# EAGLE design BLE-LORA-Relay-30dbm-v1-1 (EAGLE 8.6.0)
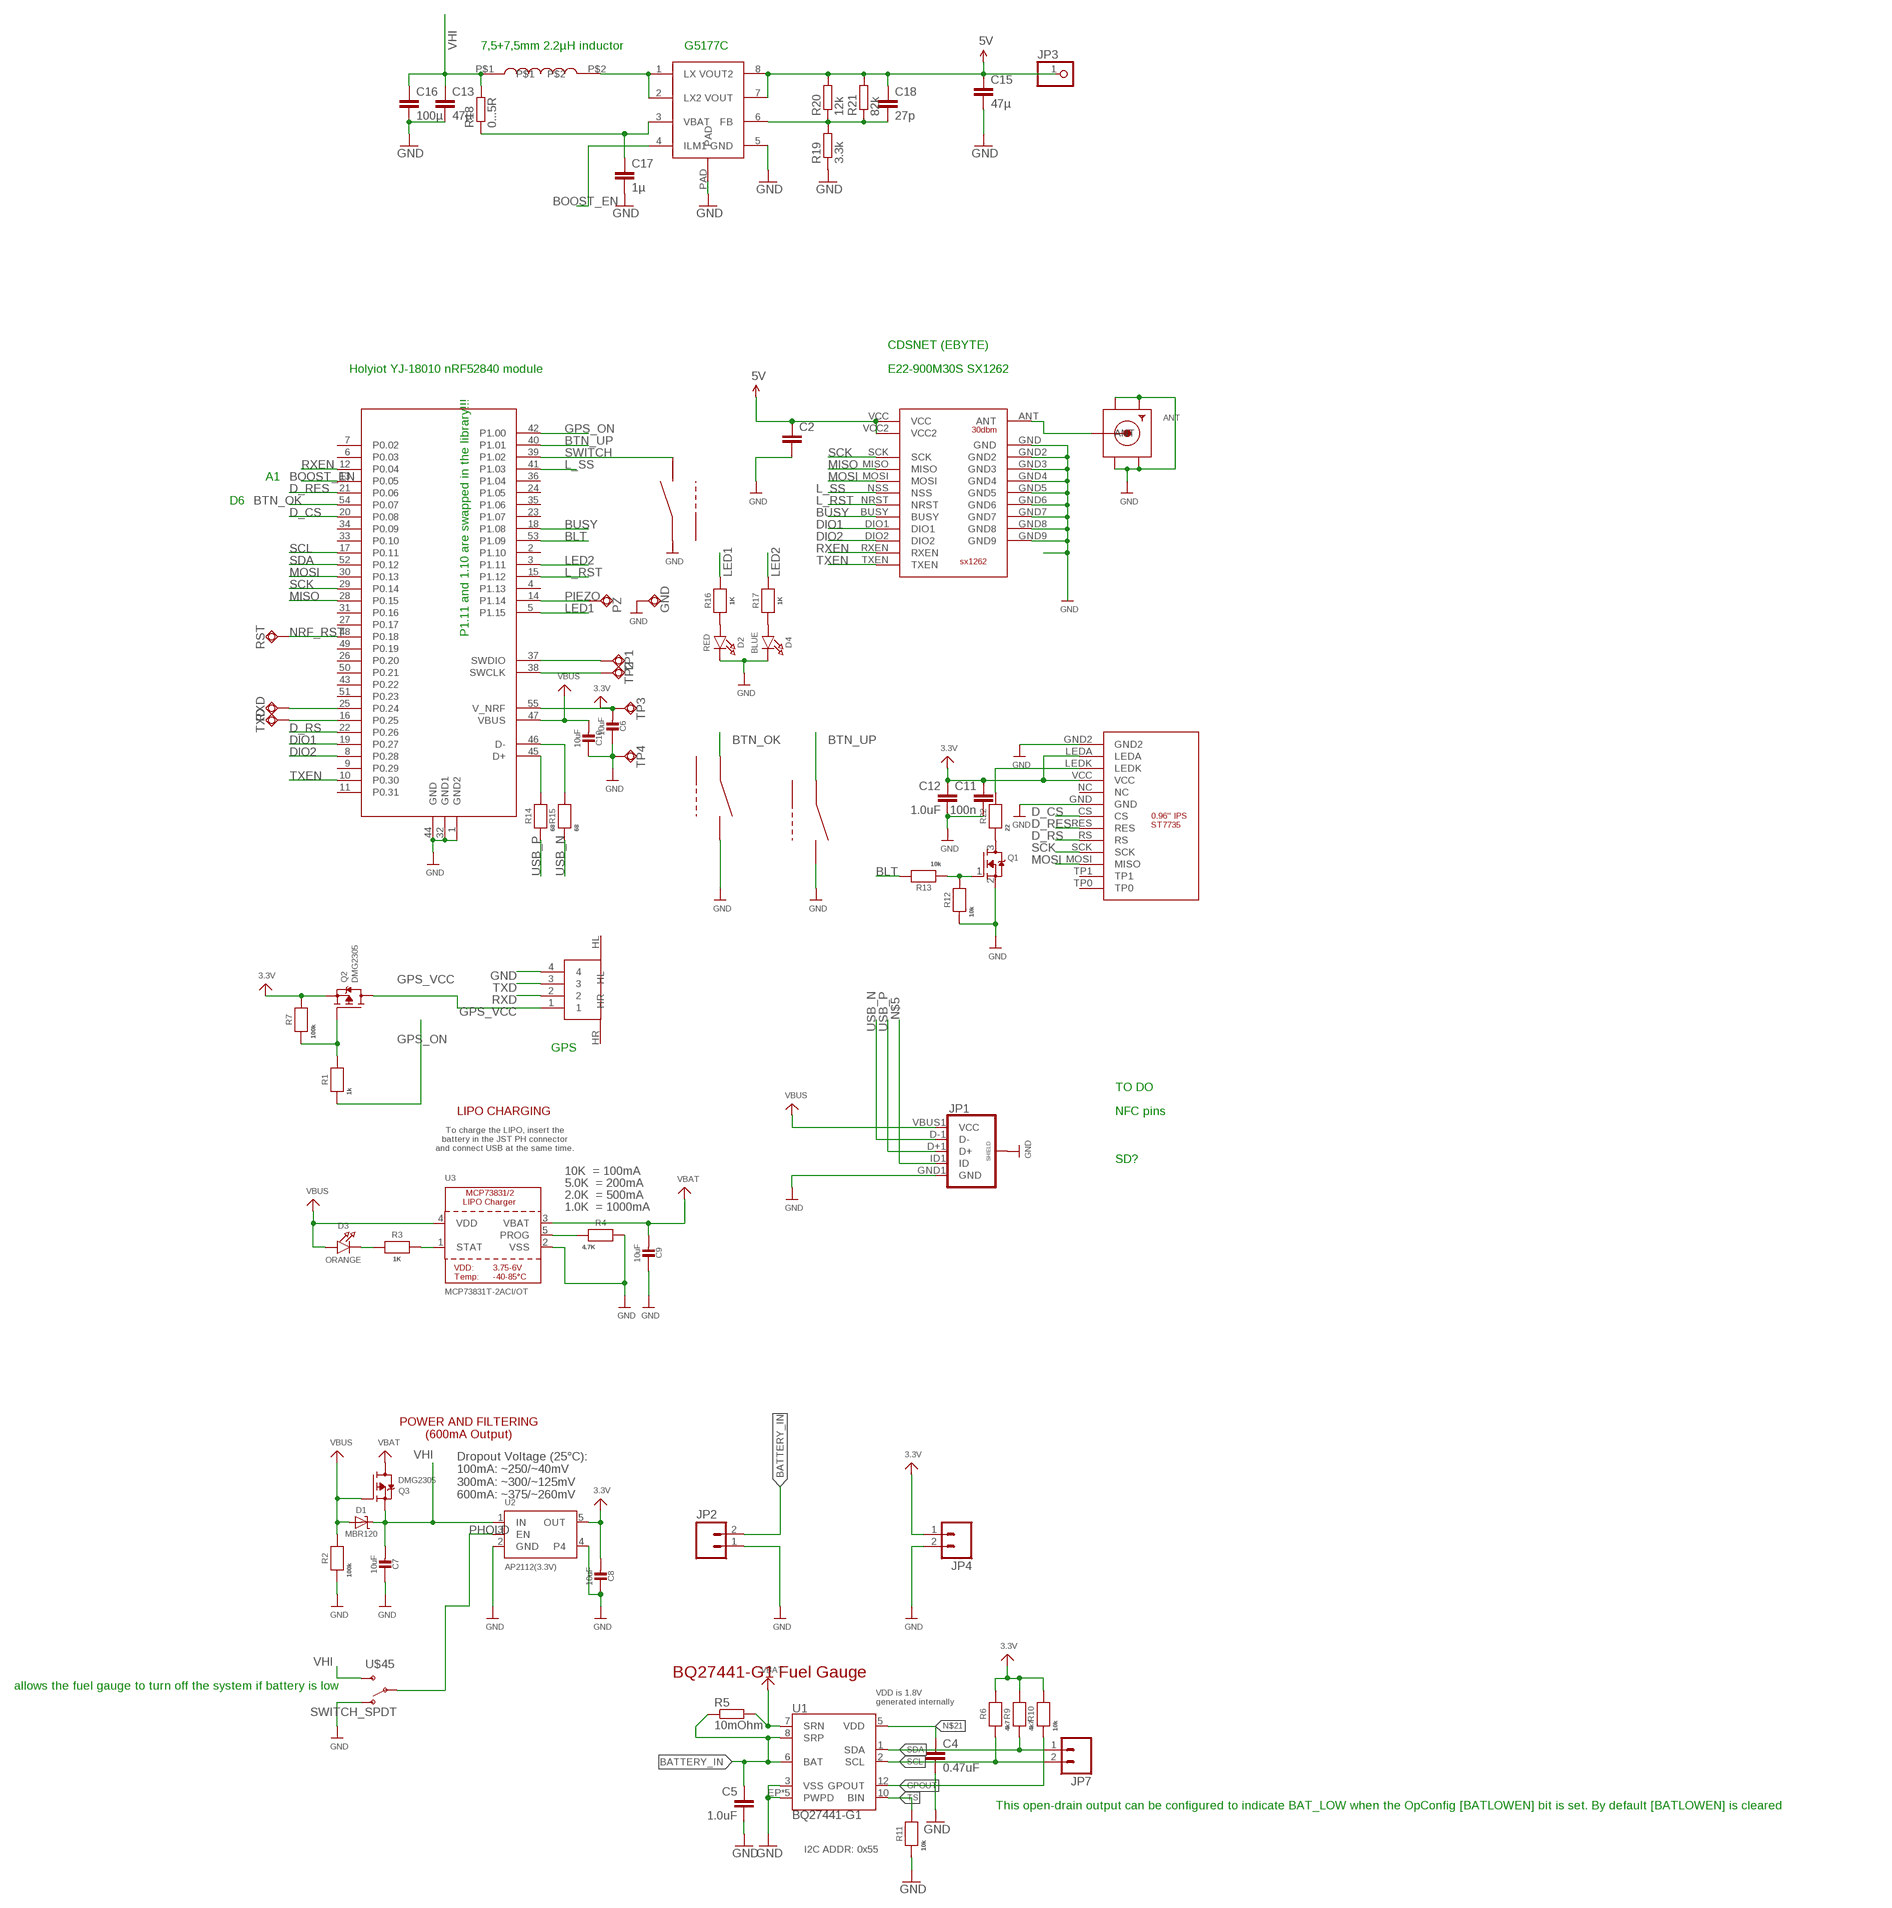
[diagram p0: schematic, sheet 1]

## Parts
ANT  SMACONNECTOR_EDGE  [SMA_EDGELAUNCH]
C2  C-EUC1206  [C1206]
C4  0.47uF  CAP0603-CAP  [0603-CAP]
C5  1.0uF  1.0UF-16V-10%(0603)  [0603-CAP]
C6  10uF  CAP_CERAMIC0805-NOOUTLINE  [0805-NO]
C7  10uF  CAP_CERAMIC0805-NOOUTLINE  [0805-NO]
C8  10uF  CAP_CERAMIC0805-NOOUTLINE  [0805-NO]
C9  10uF  CAP_CERAMIC0805-NOOUTLINE  [0805-NO]
C10  10uF  CAP_CERAMIC0805-NOOUTLINE  [0805-NO]
C11  100n  1.0UF-16V-10%(0603)  [0603-CAP]
C12  1.0uF  1.0UF-16V-10%(0603)  [0603-CAP]
C13  47µ  C-EUC0805  [C0805]
C15  47µ  C-EUC0805  [C0805]
C16  100µ  C-EUC1206  [C1206]
C17  1µ  C-EUC0603  [C0603]
C18  27p  C-EUC0603  [C0603]
D1  MBR120  DIODE-SCHOTTKYSOD-123  [SOD-123]
D2  RED  LED0805_NOOUTLINE  [CHIPLED_0805_NOOUTLINE]
D3  ORANGE  LED0805_NOOUTLINE  [CHIPLED_0805_NOOUTLINE]
D4  BLUE  LED0805_NOOUTLINE  [CHIPLED_0805_NOOUTLINE]
DWN  LS12T2  [LS12T2]
DWN1  LS12T2  [LS12T2]
DWN2  LS12T2  [LS12T2]
GND  TPSQTP13R  [TP13R]
JP1  USB_MICROB_PLUGCONN-11752  [USB-B-MICRO-SMD_V03]
JP2  M02PTH  [1X02]
JP3  PINHD-1X1  [1X01]
JP4  M02PTH  [1X02]
JP7  M02PTH  [1X02]
PZ  TPSQTP13R  [TP13R]
Q1  MOSFET-NREFLOW  [SOT23]
Q2  DMG2305  MOSFET-P  [SOT23-R]
Q3  DMG2305  MOSFET-P  [SOT23-R]
R1  1k  RESISTOR_0603_NOOUT  [0603-NO]
R2  100k  RESISTOR_0603_NOOUT  [0603-NO]
R3  1K  RESISTOR_0603_NOOUT  [0603-NO]
R4  4.7K  RESISTOR_0603_NOOUT  [0603-NO]
R5  10mOhm  R-EU_R0805  [R0805]
R6  4k7  RESISTOR_0603_NOOUT  [0603-NO]
R7  100k  RESISTOR_0603_NOOUT  [0603-NO]
R9  4k7  RESISTOR_0603_NOOUT  [0603-NO]
R10  10k  RESISTOR_0603_NOOUT  [0603-NO]
R11  10k  RESISTOR_0603_NOOUT  [0603-NO]
R12  10k  RESISTOR_0603_NOOUT  [0603-NO]
R13  10k  RESISTOR_0603_NOOUT  [0603-NO]
R14  68  RESISTOR_0603_NOOUT  [0603-NO]
R15  68  RESISTOR_0603_NOOUT  [0603-NO]
R16  1K  RESISTOR_0603_NOOUT  [0603-NO]
R17  1K  RESISTOR_0603_NOOUT  [0603-NO]
R18  0...5R  R-EU_R0603  [R0603]
R19  3.3k  R-EU_R0603  [R0603]
R20  12k  R-EU_R0603  [R0603]
R21  82k  R-EU_R0603  [R0603]
R22  22  RESISTOR_0603_NOOUT  [0603-NO]
RST  TPSQTP13R  [TP13R]
RXD  TPSQTP13R  [TP13R]
TP1  TPSQTP13R  [TP13R]
TP2  TPSQTP13R  [TP13R]
TP3  TPSQTP13R  [TP13R]
TP4  TPSQTP13R  [TP13R]
TXD  TPSQTP13R  [TP13R]
U1  BQ27441-G1  [PDSO-N12]
U2  AP2112(3.3V)  VREG_SOT23-5  [SOT23-5]
U3  MCP73831T-2ACI/OT  MCP73831/2  [SOT23-5]
U$14  NRF52840  [NRF52840MOD]
U$15  SX1262-30DBM  [SX1262-30DBM]
U$16  0.96_IPS  [0.96_IPS]
U$17  JST-SH-3  [JST-SH-3]
U$35  7.5MM-COIL  [7.5MM_COIL]
U$41  G5177C  [SO-08]
U$45  SWITCH_SPDT  [KPS-1290]

## Nets
3.3V [USB]: C6.2 C8.2 C11.1 C12.1 JP4.1 Q2.2(S) R6.2 R7.2 R9.2 R10.2 TP3.TP U2.5(OUT) U$14.55(V_NRF) U$16.LEDA U$16.VCC
5V: C2.1 C15.1 C18.1 JP3.1 R20.2 R21.2 U$15.VCC U$15.VCC2 U$41.7(VOUT) U$41.8(VOUT2)
BATTERY_IN: C5.1 JP2.2 R5.1 U1.6(BAT) U1.8(SRP)
BLT: R13.2 U$14.53(P1.09)
BOOST_EN: U$14.13(P0.05) U$41.4(ILM1)
BTN_OK [USB]: DWN.2 U$14.54(P0.07)
BTN_UP: DWN1.2 U$14.40(P1.01)
BUSY: U$14.18(P1.08) U$15.BUSY
D_CS: U$14.20(P0.08) U$16.CS
D_RES: U$14.21(P0.06) U$16.RES
D_RS: U$14.22(P0.26) U$16.RS
DIO1: U$14.19(P0.27) U$15.DIO1
DIO2: U$14.8(P0.28) U$15.DIO2
FB: C18.2 R19.2 R20.1 R21.1 U$41.6(FB)
GND: ANT.GND@1(GND4) ANT.GND@2(GND3) ANT.GND@3(GND2) ANT.GND@4(GND1) C2.2 C4.2 C5.2 C6.1 C7.1 C8.1 C9.1 C10.1 C11.2 C12.2 C13.2 C15.2 C16.2 C17.2 D2.C D4.C DWN1.1 DWN2.2 DWN.1 GND.TP JP1.GND1(GND) JP1.SHIELD1(SHIELD) JP1.SHIELD2(SHIELD) JP1.SHIELD3(SHIELD) JP2.1 JP4.2 Q1.2(S) R2.1 R4.2 R11.1 R12.1 R19.1 TP4.TP U1.3(VSS) U1.EP1(PWPD) U1.EP2(PWPD) U1.EP3(PWPD) U1.EP4(PWPD) U1.EP(PWPD) U2.2(GND) U2.4 U3.2(VSS) U$14.1(GND2) U$14.32(GND1) U$14.44(GND) U$15.GND U$15.GND2 U$15.GND3 U$15.GND4 U$15.GND5 U$15.GND6 U$15.GND7 U$15.GND8 U$15.GND9 U$16.GND U$16.GND2 U$17.4 U$41.5(GND) U$41.PAD U$45.O
GPOUT: R10.1 U1.12(GPOUT)
GPS_ON: R1.1 U$14.42(P1.00)
GPS_VCC: Q2.3(D) U$17.1
L_RST: U$14.15(P1.12) U$15.NRST
L_SS: U$14.41(P1.03) U$15.NSS
LED1: R16.2 U$14.5(P1.15)
LED2: R17.2 U$14.3(P1.11)
MISO: U$14.28(P0.15) U$15.MISO
MOSI: U$14.30(P0.13) U$15.MOSI U$16.MOSI(MISO)
N$1: D3.C R3.1
N$2: Q1.1(G) R12.2 R13.1
N$3: ANT.P(ANT) U$15.ANT
N$4: R22.2 U$16.LEDK
N$5: JP1.ID1(ID)
N$6: R14.2 U$14.45(D+)
N$7: R15.2 U$14.46(D-)
N$8: Q2.1(G) R1.2 R7.1
N$11: R3.2 U3.1(STAT)
N$12: R4.1 U3.5(PROG)
N$13: D2.A R16.1
N$14: D4.A R17.1
N$15: Q1.3(D) R22.1
N$16: C17.1 R18.1 U$41.3(VBAT)
N$17: U$35.P$2 U$41.1(LX) U$41.2(LX2)
N$21: C4.1 U1.5(VDD)
NRF_RST: RST.TP U$14.48(P0.18)
PHOLD: U2.3(EN) U$45.P
PIEZO: PZ.TP U$14.14(P1.14)
RXD: RXD.TP U$14.25(P0.24) U$17.2
RXEN: U$14.12(P0.04) U$15.RXEN
SCK: U$14.29(P0.14) U$15.SCK U$16.SCK
SCL: JP7.2 R6.1 U1.2(SCL) U$14.17(P0.11)
SDA: JP7.1 R9.1 U1.1(SDA) U$14.52(P0.12)
SWCLK: TP2.TP U$14.38(SWCLK)
SWDIO: TP1.TP U$14.37(SWDIO)
SWITCH: DWN2.1 U$14.39(P1.02)
TS: R11.2 U1.10(BIN)
TXD: TXD.TP U$14.16(P0.25) U$17.3
TXEN: U$14.10(P0.30) U$15.TXEN
USB_N: JP1.D-1(D-) R15.1
USB_P: JP1.D+1(D+) R14.1
VBAT [USB]: C9.2 Q3.3(D) R5.2 U1.7(SRN) U3.3(VBAT)
VBUS [USB]: C10.2 D1.A D3.A JP1.VBUS1(VCC) Q3.1(G) R2.2 U3.4(VDD) U$14.47(VBUS)
VHI [USB]: C7.2 C13.1 C16.1 D1.C Q3.2(S) R18.2 U2.1(IN) U$35.P$1 U$45.S
Unconnected: DWN1.FRAME(FRM) DWN2.FRAME(FRM) DWN.FRAME(FRM) U$14.2(P1.10) U$14.4(P1.13) U$14.6(P0.03) U$14.7(P0.02) U$14.9(P0.29) U$14.11(P0.31) U$14.23(P1.07) U$14.24(P1.05) U$14.26(P0.20) U$14.27(P0.17) U$14.31(P0.16) U$14.33(P0.10) U$14.34(P0.09) U$14.35(P1.06) U$14.36(P1.04) U$14.43(P0.22) U$14.49(P0.19) U$14.50(P0.21) U$14.51(P0.23) U$16.NC U$16.TP0 U$16.TP1 U$17.HL U$17.HR

## Notes on the sheet
- 7,5+7,5mm 2.2µH inductor | G5177C
- CDSNET (EBYTE)
- Holyiot YJ-18010 nRF52840 module | E22-900M30S SX1262
- A1
- D6
- P1.11 and 1.10 are swapped in the library!!!
- GPS
- TO DO
- LIPO CHARGING | NFC pins
- To charge the LIPO, insert the
  battery in the JST PH connector
  and connect USB at the same time.
- SD?
- 10K  = 100mA
- 5.0K  = 200mA
- 2.0K  = 500mA
- 1.0K  = 1000mA
- POWER AND FILTERING
  (600mA Output)
- Dropout Voltage (25°C):
  100mA: ~250/~40mV
  300mA: ~300/~125mV
  600mA: ~375/~260mV
- BQ27441-G1 Fuel Gauge
- allows the fuel gauge to turn off the system if battery is low
- VDD is 1.8V
  generated internally
- This open-drain output can be configured to indicate BAT_LOW when the OpConfig [BATLOWEN] bit is set. By default [BATLOWEN] is cleared
- I2C ADDR: 0x55

## Library data of the parts
ANT = adafruit:SMACONNECTOR: SMA Connector 90° DIP SMA Connector, 50 Ohm (4UConnector: 07259)
C2 C13 C15-C18 = rcl:C-EU: CAPACITOR, European symbol
C4 = SparkFun-Capacitors:CAP: Capacitor Standard 0603 ceramic capacitor, and 0.1" leaded capacitor.; PROD_ID: CAP-13216
C5 C12 = SparkFun-Capacitors:1.0UF-16V-10%(0603): CAP-00868; PROD_ID: CAP-00868
C6-C10 = microbuilder:CAP_CERAMIC: Ceramic Capacitors For new designs, use the packages preceded by an '_' character since they are more reliable: The following footprints should be used on most boards: _0402 - Standard footprint for regular board layouts _0603 - Standard footprint for regular board layouts _0805 - Standard footprint for regular board layouts _1206 - Standard footprint for regular board layouts For extremely tight-pitch boards where space is at a premium, the following 'micro-pitch' footprints can be used (smaller pads, no silkscreen outline, etc.): _0402MP - Micro-pitch footprint for very dense/compact boards _0603MP - Micro-pitch footprint for very dense/compact boards _0805MP - Micro-pitch footprint for very dense/compact boards _1206MP - Micro-pitch footprint for very dense/compact boards
C11 = SparkFun-Capacitors:1.0UF-16V-10%(0603): CAP-00868; PROD_ID: CAP-00868; VALUE: 1.0uF
D1 = microbuilder:DIODE-SCHOTTKY
D2-D4 = microbuilder:LED: LED 0603 - 0603 Surface Mount Package 2mA: Green LED - Low Power (3.9mcd, 2ma, 1.7Vf) - Digikey: 475-2709-2-ND Orange LED - Low Power (9.8mcd, 2ma, 1.8Vf) - Digikey: 475-1194-2-ND Red LED - Low Power (5mcd, 2ma, 1.8Vf) - Digikey: 475-1195-2-ND Yellow LED - Low Power (7mcd, 2ma, 1.8Vf) - Digikey: 475-1196-2-ND 5mA: Blue LED - Low Power (17mcd, 5ma, 2.9Vf) - Digikey: LNJ937W8CRACT-ND 0805 - 0805 Surface Mount Package 2mA: Red LED (8.8mcd, 2mA, 1.8Vf, Clear) - Low Power [Digikey: 475-2510-1-ND] Green LED (5mcd, 2mA, 1.8Vf, Clear) - Low Power [Digikey: 475-2730-1-ND] Yellow LED (11.3mcd, 2mA, 1.8Vf, Clear) - Low Power [Digikey: 475-2555-1-ND] 20mA: Red LED (104mcd, 20mA, Diffused) - LS R976 [Digikey: 475-1278-6-ND] Red LED (12mcd, 20mA, 2.0Vf, Clear) - APT2012EC [Digikey: 754-1128-1-ND] Green LED (15mcd, 20mA, 2.2Vf, Clear) - APT2012GC [Digikey: 754-1131-1-ND] Orange LED (160mcd, 20mA, 2.1Vf, Clear) - APT2012SECK [Digikey: 754-1130-1-ND] 1206 - 1206 Surface Mount Package Green LED (26mcd, 20mA, Diffused) - LG N971 [Digikey: 475-1407-6-ND] Red LED (15mcd, 20mA, Diffused) - LH N974 [Digikey: 475-1416-6-ND] Cree - Cree High-Power Surface Mount LEDs XPEBWT-L1-0000-00D50 - White 111lm 350mA 2.9Vf 6200K 110° XTEAWT-00-0000-00000LEE3 - White 114lm 350mA 2.85Vf 5000K 115° Everlight - Everlight 45-21 Series Surface Mount LEDs 45-21/QK2C-B2832AC2CB2/2T - Warm White 2000mcd 20mA 3.25Vf 3050K 120° 45-21/LK2C-B38452C4CB2/2T - Nuetral White 2000mcd 20mA 3.25Vf 4150K 120° 45-21/LK2C-B50634C6CB2/2T - Cold White 2200mcd 20mA 3.25Vf 5650K 120° PLCC2 Reverse Mount LS T77K-J1L2-1-0-2-R18-Z - Red 11.25mcd 2mA 1.8Vf 630nm 120° LO T77K-L1M2-24-Z - Orange 19.6mcd 2mA 1.8Vf 606nm 120° LY T77K-K2M1-26-Z - Yellow 15.7mcd 2mA 1.8Vf 587nm 120°
DWN DWN1 DWN2 = LS12T2:LS12T2
GND PZ RST RXD TP1-TP4 TXD = testpad:TPSQ: Test pad
JP1 = SparkFun-Connectors:USB_MICROB_PLUG: USB Micro-B connectors Some male, some female. Watch your step!; PROD_ID: CONN-11752
JP2 JP4 JP7 = SparkFun-Connectors:M02: Standard 2-pin 0.1" header. Use with - straight break away headers ( PRT-00116) - right angle break away headers (PRT-00553) - swiss pins (PRT-00743) - machine pins (PRT-00117) - female headers (PRT-00115) Molex polarized connector foot print use with: PRT-08233 with associated crimp pins and housings. 2.54_SCREWTERM for use with PRT-10571. 3.5mm Screw Terminal footprints for PRT-08084 5mm Screw Terminal footprints for use with PRT-08432
JP3 = adafruit:PINHD-1X1: Pin header 1x1 for 0.1" spacing With round pins
Q1 = adafruit:MOSFET-N: N-Channel Mosfet 2N7002E - 60V 260mA SOT23 [Digikey: 2N7002ET1GOSTR-ND] - REEL BSH103 - 30V 850mA SOT23 [Digikey: 568-5013-1-ND]
Q2 Q3 = microbuilder:MOSFET-P: P-Channel Mosfet LEGEND VDS: Voltage Drain-Source ID: Drain Current RDS(ON): Drain-Source On-State Resistance VGS(TH): Gate-Source Threshold Voltage CISS: Drain-Source Input Capacitance SOT-23 Name VDS ID RDS(ON) VGS(TH) CISS Order Number IRLML5103 30V 760mA 600 mOhm -- 75pF @ 25V Digikey: IRLML5103PBFCT-ND IRLML6401 12V 4.3A 50 mOhm 950mV @ 250µA 830pF @ 10V Digikey: IRLML6401PBFTR-ND NTR0202PL 20V 400mA 800 mOhm 2.3V @ 250uA 70pF @ 5V Digikey: NTR0202PLT1GOSTR-ND NTR4101PT1G 20V 1.8A 85 mOhm 1.2V @ 250uA 675pF @ 10V Digikey: NTR4101PT1GOSCT-ND DMP2004K 20V 600mA 900 mOhm 1V @ 250uA 175pF @ 16V Digikey: DMP2004KDICT-ND PMV65XP 20V 3.9A 76 mOhm 950mV @ 1mA 725pF @ 20V Digikey: 568-2358-2-ND TO-252 Name VDS ID RDS(ON) VGS(TH) CISS Order Number AOD417 30V 25A 34 mOhm 3V @ 250µA 920pF @ 15V Digikey: 785-1106-2-ND PowerPak Name VDS ID RDS(ON) VGS(TH) CISS Order Number AON7401 30V 12A 14 mOhm 3V @ 250µA 2600pF @ 15V Digikey: 785-1302-1-ND
R1-R4 R6 R7 R9-R17 R22 = microbuilder:RESISTOR: Resistors For new designs, use the packages preceded by an '_' character since they are more reliable: The following footprints should be used on most boards: _0402 - Standard footprint for regular board layouts _0603 - Standard footprint for regular board layouts _0805 - Standard footprint for regular board layouts _1206 - Standard footprint for regular board layouts For extremely tight-pitch boards where space is at a premium, the following 'micro-pitch' footprints can be used (smaller pads, no silkscreen outline, etc.): _0402MP - Micro-pitch footprint for very dense/compact boards _0603MP - Micro-pitch footprint for very dense/compact boards _0805MP - Micro-pitch footprint for very dense/compact boards _1206MP - Micro-pitch footprint for very dense/compact boards
R5 R18-R21 = rcl:R-EU_: RESISTOR, European symbol
U1 = battery-management-temp:BQ27441-G1; PROD_ID: IC-13220
U2 = microbuilder:VREG_SOT23-5: SOT23-5 Fixed Voltage Regulators Part Current Out V Out V In V Dropout θJA (°C/W) TJ (°C) Digikey Part No. ADP121 150mA 3.3V 3.4-5.5V 0.09V @ 150mA -- -- ADP121-AUJZ33R7CT-ND ADP121 150mA 3.0V 3.1-5.5V 0.09V @ 150mA -- -- ADP121-AUJZ30R7CT-ND ADP122 300mA 3.3V 3.4-5.5V 0.085V @ 300mA -- -- ADP122AUJZ-3.3-R7CT-ND ADP1712 300mA 3.3V 3.5-5.5V 0.17V @ 300mA -- -- ADP1712AUJZ-3.3-R7TR-ND AP7311 (Low Cost) 150mA 3.3V 3.5-6V 0.15V @ 150mA -- -- AP7311-33WG-7DICT-ND LD39015M18R 150mA 1.8V 1.9V-5.5V 0.08V @ 100mA -- -- 497-6977-1-ND LP2985A-33DBVR 150mA 3.3V 3.3-16V 0.28V @ 150mA 206 150 296-18479-1-ND MCP1824T-3302E/OT 300mA 3.3V 3.5V-6V 0.2V @ 300mA -- -- MCP1824T-3302E/OTCT-ND MIC5205-2.5YM5 TR 150mA 2.5V 2.7-16V 0.165V @ 150mA -- -- 576-1257-2-ND MIC5205-3.0YM5 TR 150mA 3.0V 3.2V-16V 0.165V @ 150mA -- -- 576-1258-2-ND MIC5205-3.3YM5 TR 150mA 3.3V 3.5V-16V 0.165V @ 150mA -- -- 576-1259-2-ND TPS780330220 150mA 3.3V+2.2V 3.6-5.5V 250mV Max -- -- 296-23332-1-ND TDA3663/N1,135 100mA 3.3V 3.5-45V 0.18V @ 50mA -- -- 568-5343-1-ND Max operating temp can be calculated using θJA, TJ (max junction temperature), and power in watts. Set the "Maximum Ambient Temperature" until it reaches TJ ("Max Junction Temperature"), which is the absolute limit for safe use of the regulator: Heat Sink Temperature Calculator <http://www.daycounter.com/Calculators/Heat-Sink-Temperature-Calculator.phtml> For example, With 12V source into a 3.3V LP2985 and a 30mA load, we are dissipating (12V-3.3V) * 0.03A = 0.261W. With a θJA of 206 °C/W, a TJ of 150°C, and 261mW we can safely use the chip without a heat sink up to 75°C (=147.1°C Junction Temperature).
U3 = microbuilder:MCP73831/2: MCP73831/2 LIPO Charger VDD: 3.75 - 6V Temp -40 - 85°C Programmable Charge Rate: 15-500mA NOTE: STAT is a tri-state logic output on the MCP73831 and an open-drain output on the MCP73832. SOT23-5 with 4.2V output and tri-state logic on STAT = MCP73831T-2ACI/OT
U$14 = nrf52840mod:NRF52840
U$15 = SX1262-30dbm:SX1262-30DBM
U$16 = 0.96_IPS:0.96_IPS
U$17 = JST-SH-4:JST-SH-3
U$35 = 7.5mm-COIL:7.5MM-COIL
U$41 = G5177C:G5177C
U$45 = SparkFun-Retired:SWITCH_SPDT: SWCH-10651 Side-actuated SPDT slide switch, as used on the Arduino Pro; PROD_ID: SWCH-10651

## Net classes
1 USB: width 0.406 mm

## Board
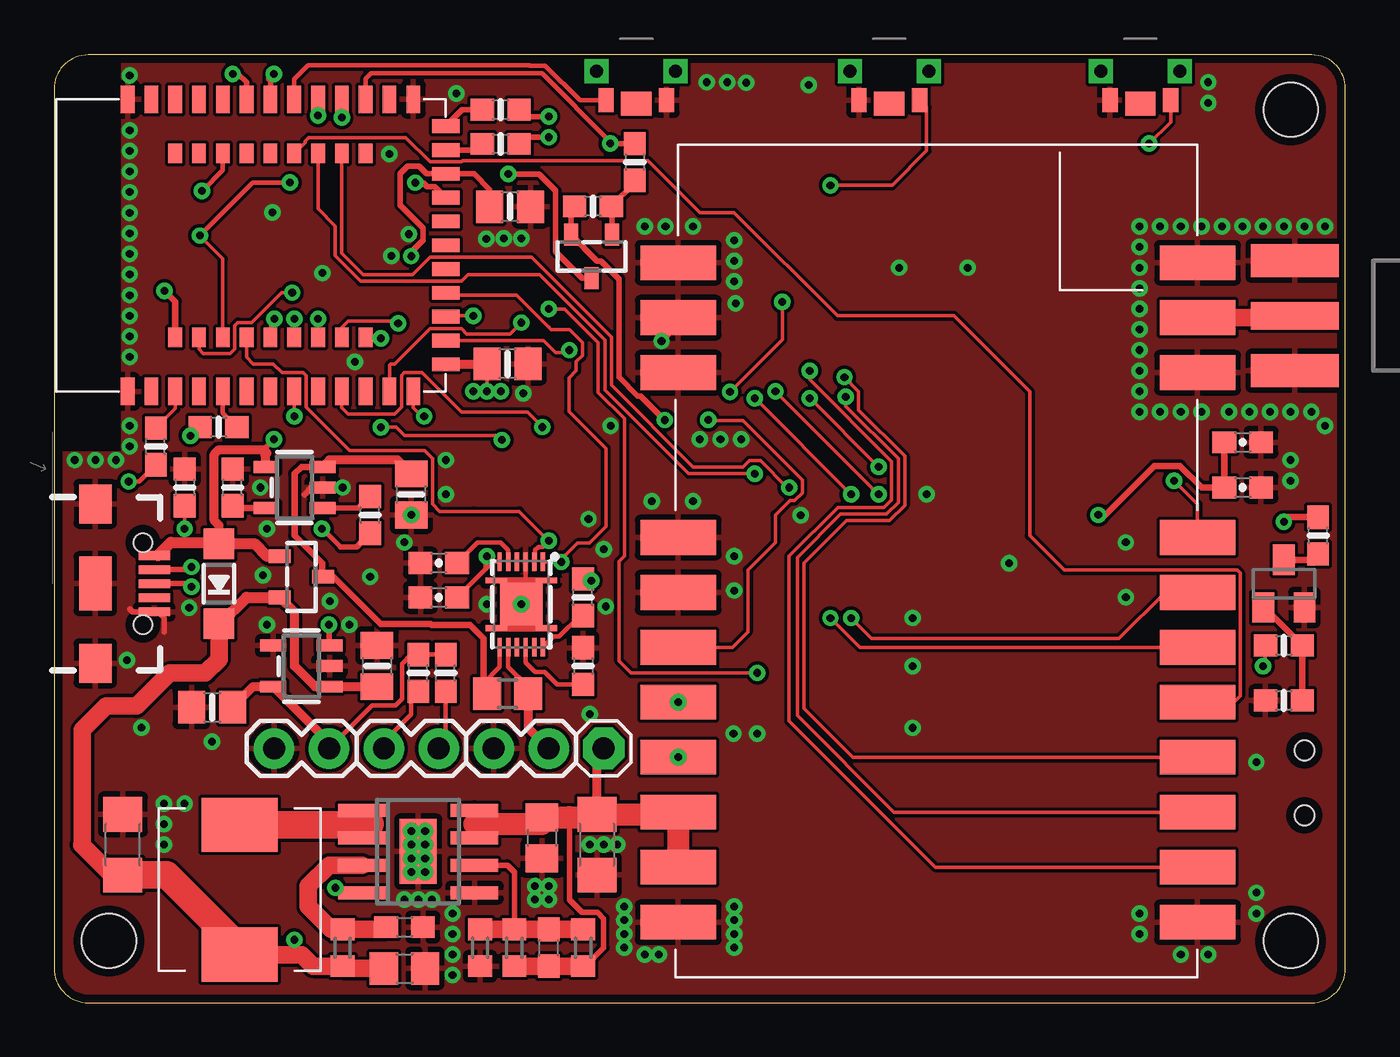
[diagram p1: board, top side]
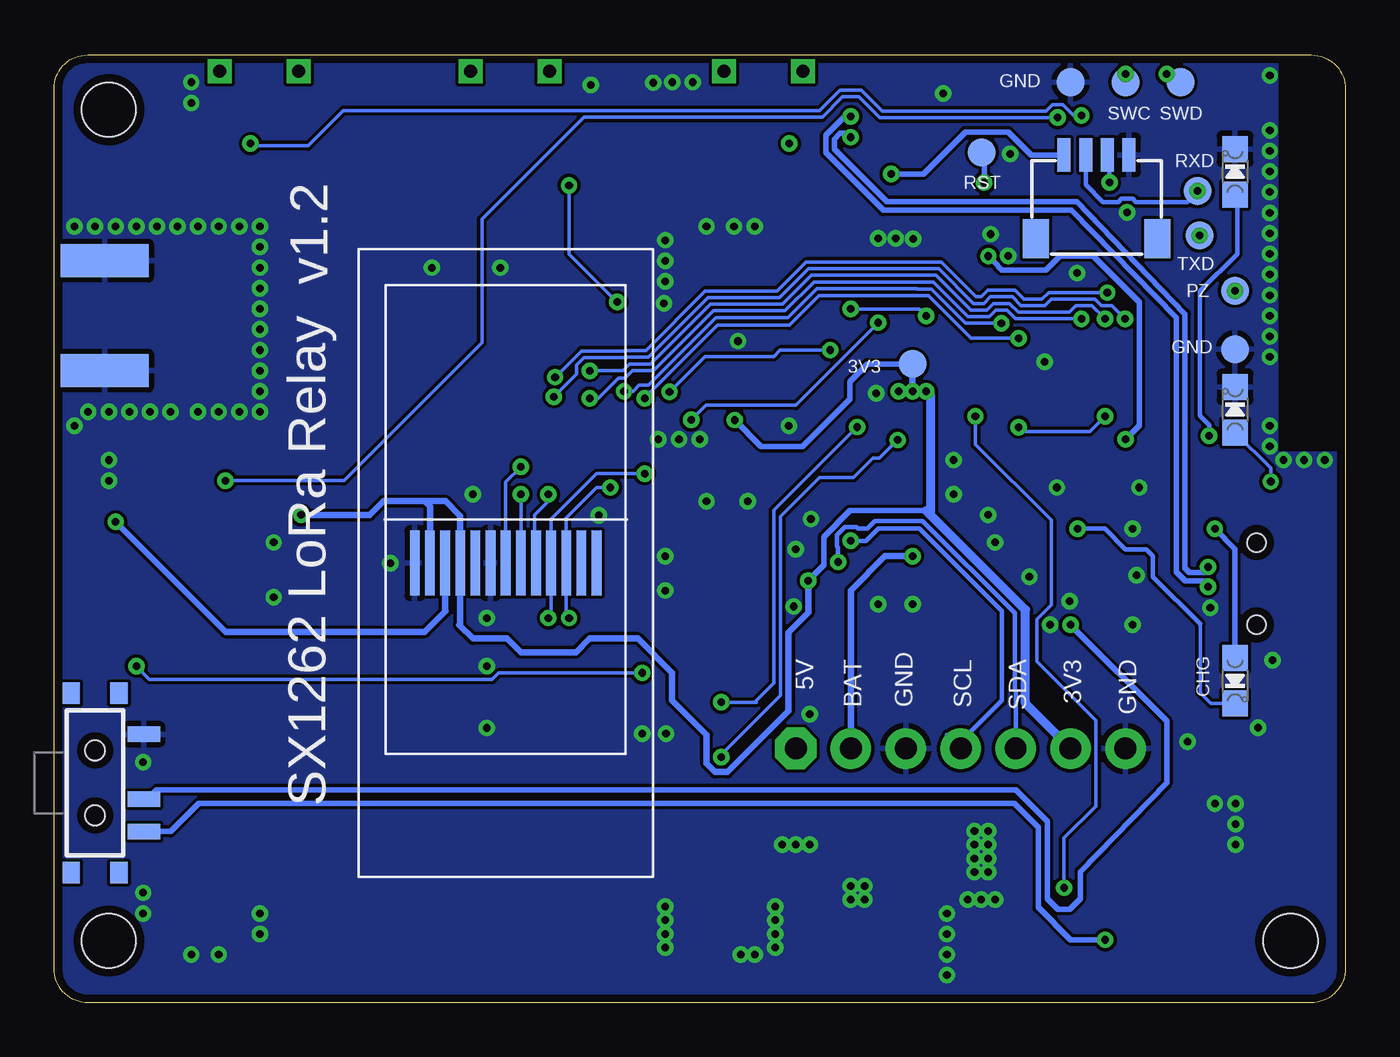
[diagram p2: board, bottom side, seen from below]

Size 59.68 x 43.8 mm. Coordinates in mm from the lower left corner, seen from the top.
Outline: 58.13,43.8 1.57,43.8 arc90 0,42.23 0,1.59 arc90 1.59,0 58.11,0 arc90 59.68,1.57 59.68,42.26 arc90 58.13,43.8
Copper layers (1*16): Top 0.035mm / dielectric 1.5mm / Bottom 0.035mm
Design rules "default *": minimum track width 6mil, minimum drill 0.35mm, track to track 6mil, track to pad 6mil, pad to pad 6mil, via to via 6mil, smd to smd 6mil, copper to edge 15mil, drill to drill 6mil, minimum pad ring 10mil, minimum via ring 8mil, stop-mask expansion 4mil, vias tented up to drill 20mil, thermal gap 10mil
Holes 2.5 mm at 2.54,2.86 57.15,2.86 57.15,41.28

### Footprints (pad centres in the part's own frame; a part is rotated, then mirrored left to right if it is on the bottom)
SMA_EDGELAUNCH = smd 4.064 x 1.524: GND@1 2.032,-2.54; GND@2 2.032,2.54 | smd 4.064 x 1.524 bottom: GND@3 2.032,2.54; GND@4 2.032,-2.54 | smd 4.064 x 1.27: P 2.032,0
C1206 = smd 1.6 x 1.8: 1 -1.4,0; 2 1.4,0
0603-CAP = smd 1.1 x 1: 1 -0.85,0; 2 0.85,0
0805-NO = smd 1.24 x 1.5: 1 -0.95,0; 2 0.95,0
C0805 = smd 1.3 x 1.5: 1 -0.95,0; 2 0.95,0
C0603 = smd 1.1 x 1: 1 -0.85,0; 2 0.85,0
SOD-123 = smd 1.4 x 1.4: A 1.85,0; C -1.85,0
CHIPLED_0805_NOOUTLINE = smd 1.2 x 1.2: A 0,-1.05; C 0,1.05
LS12T2 = smd 1.1 x 0.7: 1 0,1.4; 2 0,-1.4 | smd 1.1 x 1.4: FRAME -0.15,0 | drill 0.6 pad 1.016 square: P$4 1.35,-1.825; P$5 1.35,1.825
TP13R = smd 1.3 x 1.3: TP 0,0
USB-B-MICRO-SMD_V03 = smd 1.45 x 0.4: D+1 2.725,0; D-1 2.725,0.65; GND1 2.725,-1.3; ID1 2.725,-0.65; VBUS1 2.725,1.3 | smd 1.5 x 1.8: SHIELD1 0,3.685; SHIELD2 0,-3.685 | smd 1.5 x 2.5: SHIELD3 0,0 | hole 0.85: 2.2,1.9; 2.2,-1.9
1X02 = drill 1.016 pad 1.88: 1 0,0; 2 2.54,0
1X01 = drill 1.016 pad 1.93 octagon: 1 0,0
SOT23 = smd 1 x 1.4: 1 -0.95,-1.1; 2 0.95,-1.1; 3 0,1.1
SOT23-R = smd 0.635 x 1.016: 1 -0.95,-1; 2 0.95,-1; 3 0,1
0603-NO = smd 1.075 x 1: 1 -0.85,0; 2 0.85,0
R0805 = smd 1.3 x 1.5: 1 -0.95,0; 2 0.95,0
R0603 = smd 1 x 1.1: 1 -0.85,0; 2 0.85,0
PDSO-N12 = smd 0.2 x 0.85: 1 -1,-1.975; 2 -0.6,-1.975; 3 -0.2,-1.975; 4 0.2,-1.975; 5 0.6,-1.975; 6 1,-1.975; 7 1,1.975; 8 0.6,1.975; 9 0.2,1.975; 10 -0.2,1.975; 11 -0.6,1.975; 12 -1,1.975 | smd 1.95 x 1.95: EP 0,0 | smd 1 x 0.25: EP1 -1.15,1.1; EP2 -1.15,-1.1; EP3 1.15,-1.1; EP4 1.15,1.1
SOT23-5 = smd 0.55 x 1.2: 1 -0.95,-1.3; 2 0,-1.3; 3 0.95,-1.3; 4 0.95,1.3; 5 -0.95,1.3
NRF52840MOD = smd 1.27 x 0.635: 1 0,14.7; 2 0,13.6; 3 0,12.5; 4 0,11.4; 5 0,10.3; 6 0,9.2; 7 0,8.1; 8 0,7; 9 0,5.9; 10 0,4.8; 11 0,3.7; 12 0,2.6; 13 0,1.5; 32 13.5,14.7; 33 13.5,13.6; 34 13.5,12.5; 35 13.5,11.4; 36 13.5,10.3; 37 13.5,9.2; 38 13.5,8.1; 39 13.5,7; 40 13.5,5.9; 41 13.5,4.8; 42 13.5,3.7; 43 13.5,2.6; 44 13.5,1.5; P$7 0,8.1; P$32 13.5,8.1 | smd 0.9 x 0.635: 14 2.5,12.5; 15 2.5,11.4; 16 2.5,10.3; 17 2.5,9.2; 18 2.5,8.1; 19 2.5,7; 20 2.5,5.9; 21 2.5,4.8; 22 2.5,3.7; 23 11,12.5; 24 11,11.4; 25 11,10.3; 26 11,9.2; 27 11,8.1; 28 11,7; 29 11,5.9; 30 11,4.8; 31 11,3.7 | smd 0.635 x 1.27: 45 12.25,0; 46 11.15,0; 47 10.05,0; 48 8.95,0; 49 7.85,0; 50 6.75,0; 51 5.65,0; 52 4.55,0; 53 3.45,0; 54 2.35,0; 55 1.25,0
SX1262-30DBM = smd 3.5 x 1.6: ANT 0,2.54; BUSY 0,25.4; DIO1 0,27.94; DIO2 24,22.86; GND 24,0; GND2 24,2.54; GND3 24,5.08; GND4 24,12.7; GND5 24,15.24; GND6 24,30.48; GND7 0,30.48; GND8 0,5.08; GND9 0,0; MISO 0,20.32; MOSI 0,17.78; NRST 0,22.86; NSS 0,12.7; RXEN 24,17.78; SCK 0,15.24; TXEN 24,20.32; VCC 24,25.4; VCC2 24,27.94
0.96_IPS = smd 3 x 0.45: CS 0,4.2; GND 0,4.9; GND2 0,8.4; LEDA 0,7.7; LEDK 0,7; MOSI 0,1.4; NC 0,5.6; RES 0,3.5; RS 0,2.8; SCK 0,2.1; TP0 0,0; TP1 0,0.7; VCC 0,6.3
JST-SH-3 = smd 0.6 x 1.55: 1 1.3,3.875; 2 2.3,3.875; 3 3.3,3.875; 4 4.3,3.875 | smd 1.2 x 1.8: HL 5.6,0; HR 0,0
7.5MM_COIL = smd 2.5 x 3.5: P$1 0,0; P$2 6,0
SO-08 = smd 0.6 x 2.2: 1 -1.905,-2.6; 2 -0.635,-2.6; 3 0.635,-2.6; 4 1.905,-2.6; 5 1.905,2.6; 6 0.635,2.6; 7 -0.635,2.6; 8 -1.905,2.6 | smd 3 x 1.7: PAD 0,0
KPS-1290 = smd 0.7 x 1.5: O -2.25,2.25; P 0.75,2.25; S 2.25,2.25 | smd 1 x 0.8: P$1 -4.15,1.1; P$2 -4.15,-1.1; P$3 4.15,-1.1; P$4 4.15,1.1 | hole 0.9: -1.5,0; 1.5,0

### Placement (x,y rotation side)
ANT  59.37,31.75 180 top
C2  25.08,7.3 270 top
C4  17.78,20.32 180 top
C5  17.78,18.73 180 top
C6  20.95,29.53 180 top
C7  14.92,15.56 270 top
C8  7.3,13.65 0 top
C9  16.51,23.49 90 top
C10  21.07,36.78 180 top
C11  54.93,25.9 0 top
C12  54.93,23.81 0 top
C13  16.19,1.59 0 top
C15  22.54,7.62 270 top
C16  3.17,7.3 90 top
C17  16.19,3.49 0 top
C18  22.86,2.54 90 top
D1  7.62,19.37 90 top
D2  5.1,38.41 0 bottom
D3  5.1,14.88 180 bottom
D4  5.1,27.41 0 bottom
DWN  38.6,41.71 90 top
DWN1  50.2,41.71 90 top
DWN2  26.9,41.71 90 top
GND  5.1,30.21 0 bottom
JP1  1.91,19.37 0 top
JP2  20.32,11.75 0 top
JP3  25.4,11.75 0 top
JP4  12.7,11.75 180 top
JP7  15.24,11.75 0 top
PZ  5.1,32.91 0 bottom
Q1  56.83,19.37 0 top
Q2  24.84,34.5 180 top
Q3  11.43,19.68 270 top
R1  26.83,38.86 270 top
R2  6.03,23.81 270 top
R3  14.61,22.54 90 top
R4  8.26,23.81 90 top
R5  20.95,14.29 180 top
R6  18.1,15.24 90 top
R7  24.9,36.81 180 top
R9  16.83,15.24 90 top
R10  24.45,18.73 90 top
R11  24.45,15.56 270 top
R12  56.83,13.97 0 top
R13  56.83,16.51 180 top
R14  20.64,41.28 180 top
R15  20.64,39.69 180 top
R16  7.6,26.61 0 top
R17  4.7,25.71 90 top
R18  13.34,2.54 270 top
R19  19.68,2.54 90 top
R20  24.45,2.54 270 top
R21  21.27,2.54 270 top
R22  58.42,21.59 90 top
RST  16.8,39.31 0 bottom
RXD  6.83,37.51 0 bottom
TP1  7.62,42.55 0 bottom
TP2  10.16,42.55 0 bottom
TP3  20,29.53 0 bottom
TP4  12.7,42.55 0 bottom
TXD  6.73,35.45 0 bottom
U1  21.59,18.41 180 top
U2  11.43,15.56 90 top
U3  11.11,23.81 90 top
U$14  18.1,28.26 90 top
U$15  52.84,34.2 180 top
U$16  34.61,20.32 90 bottom
U$17  14.3,35.31 0 bottom
U$35  8.57,2.22 90 top
U$41  16.83,6.98 270 top
U$45  57.78,10.16 270 bottom

### Tracks (layer width: path | path; a pad name or v marks a point on that pad's centre or on a via)
3.3V  (via drill 0.35)
  Top 0.152: v19.37,28.26 v20,28.26 | TP3.TP v20,28.26
  Top 0.2: JP4.1 14.69,13.74 15.78,13.74 16.07,14.03 16.07,15.67 16.51,16.1 R9.2 R6.2
  Top 0.254: v20,28.26 | R10.2 24.74,19.58 v24.82,19.51 | R7.2 23.89,36.65 Q2.2 25.1,34.28 25.27,34.28 26.11,33.45 26.11,28.9 26.97,28.04 27.11,28.04 v28.22,26.93
  Top 0.305: C11.1 C12.1 53.04,23.81 52.03,24.81 50.85,24.81 48.58,22.54 v48.26,22.54
  Top 0.406: JP4.1 12.7,12.04 U2.5 9.21,14.61 C8.2 | U$14.55 18.12,29.53 TP3.TP | v20,28.26 v20.64,28.26
  Bottom 0.152: 19.37,22.64 19.37,22.74
  Bottom 0.203: 12.7,12.38 JP4.1
  Bottom 0.254: v24.82,19.51 24.1,20.22 24.1,21.53 22.9,22.74 19.37,22.74 | v28.22,26.93 27,25.71 25.1,25.71 22.9,27.91 22.9,28.71 22.08,29.53 TP3.TP
  Bottom 0.305: TP3.TP v20,28.26 | v48.26,22.54 45.09,22.54 44.45,23.18 42.55,23.18 | 42.55,23.18 41.59,23.18 40.91,22.49 U$16.VCC 40.91,17.51 40.96,17.46 40.32,16.83 38.73,16.83 38.1,16.19 35.56,16.19 34.92,16.83 32.7,16.83 31.11,15.24 31.11,13.97 29.52,12.38 29.52,11.06 29.12,10.66 28.56,10.66 25.73,13.49 25.73,17.12 24.82,18.03 v24.82,19.51 | U$16.LEDA 42.31,22.94 42.55,23.18
  Bottom 0.406: JP4.1 14.78,13.83 14.78,18.15 19.17,22.54 | 19.17,22.54 19.37,22.74 | v19.37,28.26 19.17,28.06 19.17,22.54
5V
  Top 0.254: 23.81,1.69 24.55,1.69 25.4,2.54 25.4,3.88 25.11,4.17 24.41,4.17 23.81,4.76 23.81,8.57 | 28.93,8.71 U$15.VCC
  Top 0.406: C2.1 25.08,11.43 JP3.1
  Top 0.61: U$41.7 19.43,8.25 U$41.8 | 22.54,8.25 C15.1
  Top 0.813: R21.2 C18.1 23.81,1.69 R20.2
  Top 1.016: 19.43,8.25 22.54,8.25 | C15.1 23.81,8.57 25.08,8.57 C2.1 28.84,8.7 U$15.VCC U$15.VCC2
BATTERY_IN  (via drill 0.35)
  Top 0.203: U1.8 20.99,15.52 21.91,14.61 | C5.1 19.95,20.05 | 19.95,20.05 20.29,20.39 U1.6 | 19.95,20.05 19.95,20.59 v20,20.64
  Top 0.254: 21.91,14.61 R5.1
  Top 0.406: R5.1 21.91,12.7 JP2.2
  Bottom 0.305: JP2.2 22.86,19.05 21.27,20.64 v20,20.64
BLT  (via drill 0.35)
  Top 0.152: v22.86,32.07 23.59,32.07 25.15,30.51 25.15,28.19 26.35,26.99 26.35,20.64 26.11,20.39 26.11,15.8 26.67,15.24 v32.5,15.24 | v19.37,31.75 18.14,31.75 U$14.53 | v55.88,15.56 55.98,15.66 R13.2
  Bottom 0.152: v22.86,32.07 19.68,32.07 v19.37,31.75 | v32.5,15.24 39.15,15.24 39.44,14.95 55.27,14.95 v55.88,15.56
BOOST_EN  (via drill 0.35)
  Top 0.152: U$14.13 16.6,27.51 17,27.11 v17.1,27.11 | U$41.4 13.23,5.08 v13,5.31
  Bottom 0.152: v17.1,27.11 17.1,25.81 13.6,22.31 13.6,18.37 14.26,17.71 14.26,15.77 11.53,13.04 11.53,9.08 13,7.61 v13,5.31
BTN_OK  (via drill 0.35)
  Top 0.152: U$14.54 22.63,30.61 23.18,30.06 23.71,30.06 v23.81,30.16 | v31.24,28.23 33.66,30.65 v33.66,32.38 | v35.88,37.78 38.73,37.78 40.32,39.37 40.32,41.39 DWN.2
  Bottom 0.152: v23.81,30.16 26.13,30.16 26.42,29.87 29.59,29.87 v31.24,28.23 | v33.66,32.38 35.88,34.61 v35.88,37.78
BTN_UP  (via drill 0.35)
  Top 0.152: U$14.40 v12.2,41.01 | v50.6,39.71 51.6,40.71 DWN1.2
  Bottom 0.152: v12.2,41.01 12.54,41.01 13.05,41.51 13.55,41.51 13.85,41.21 21.39,41.21 22.36,42.17 23.36,42.17 24.3,41.23 46.31,41.23 47.94,39.61 50.6,39.61 v50.6,39.71
BUSY  (via drill 0.35)
  Top 0.152: U$14.18 10,31.42 v10.18,31.61 | v36.58,28 36.58,27.58 39.01,25.14 39.01,23.12 38.48,22.58 36.35,22.58 34.35,20.58 34.35,13.28 38.82,8.8 U$15.BUSY
  Bottom 0.152: v10.18,31.61 10.79,32.21 11.28,32.21 11.58,32.52 13.59,32.52 13.89,32.22 14.99,32.22 15.4,32.62 16.4,32.62 16.71,32.32 17.19,32.32 18.79,33.92 24.81,33.92 26.14,32.59 27.94,32.59 28.03,32.59 29.46,32.59 32.2,29.84 33.18,29.84 33.21,29.82 33.34,29.82 35.18,29.82 35.53,29.46 35.53,29.05 v36.58,28
D_CS  (via drill 0.35)
  Top 0.152: U$14.20 v12.2,31.61 | v34.92,27.94 v38.1,24.76
  Bottom 0.152: v12.2,31.61 15.24,31.61 15.65,32.01 16.15,32.01 16.45,31.71 17.44,31.71 19.04,33.31 24.56,33.31 25.89,31.98 28.26,31.98 28.28,31.98 29.21,31.98 31.98,29.21 32.96,29.21 33.3,28.86 33.59,28.86 34.51,27.94 v34.92,27.94 | v38.1,24.76 38.81,24.06 U$16.CS
D_RES  (via drill 0.35)
  Top 0.152: U$14.21 13.3,31.2 13.6,31.51 15.8,31.51 v15.9,31.41 | v33.34,28.26 v38.1,23.49
  Bottom 0.152: v15.9,31.41 17.57,31.41 19.14,32.98 19.77,32.98 19.8,33.01 24.43,33.01 25.77,31.67 26.99,31.67 28.41,31.67 29.08,31.67 32.21,28.55 32.64,28.55 32.93,28.26 v33.34,28.26 | v38.1,23.49 U$16.RES
D_RS  (via drill 0.35)
  Top 0.152: U$14.22 15.05,30.76 v15.1,30.71 | v32.38,27.94 v36.83,23.49
  Bottom 0.152: v15.1,30.71 17.3,30.71 19.27,32.67 24.33,32.67 25.7,31.31 28.89,31.31 28.9,31.31 29.02,31.31 v32.38,27.94 | v36.83,23.49 36.83,23.18 37.47,22.54 37.47,20.38 U$16.RS
DIO1  (via drill 0.35)
  Top 0.152: U$14.19 v11.1,31.61 | v34.92,29.21 34.92,28.8 38.71,25.02 38.71,23.24 38.35,22.89 36.22,22.89 33.97,20.64 33.97,13.02 40.73,6.26 U$15.DIO1
  Bottom 0.152: v11.1,31.61 11.71,32.21 12.45,32.21 12.75,31.91 15.12,31.91 15.52,32.32 16.28,32.32 16.58,32.02 17.32,32.02 18.92,33.62 24.68,33.62 26.02,32.28 29.34,32.28 32.1,29.51 33.08,29.51 33.39,29.21 v34.92,29.21
DIO2  (via drill 0.35)
  Top 0.152: U$14.8 v11.1,27.11 | v20.7,26.01 20.5,26.21 16.2,26.21 15.81,26.6 v15.1,26.6
  Bottom 0.152: v11.1,27.11 11.8,26.41 14.91,26.41 v15.1,26.6 | v20.7,26.01 21.52,25.18 21.83,25.18 22.73,24.28 24.3,24.28 26.11,22.47 26.11,14.21 28.75,11.57 28.75,11.43 v28.84,11.34
FB
  Top 0.254: U$41.6 20.95,6.35 21.27,6.03 R21.1
  Top 0.813: R19.2 R21.1 C18.2 R20.1
GND  (via drill 0.35)
  Top 0.2: U1.EP1 22.05,17.31 21.59,17.78 | 21.59,17.78 U1.EP 21.59,19.05 | U1.EP4 21.12,17.31 21.59,17.78 | U1.EP2 22.05,19.51 21.75,19.21 21.59,19.05 | U1.EP3 21.12,19.51 21.59,19.05
  Top 0.203: U1.3 21.79,19.25 21.75,19.21
  Top 0.254: 5.08,17.15 5.08,17.78 4.79,18.07 JP1.GND1 3.64,18.07 3.5,18.21 | v28.07,30.58 28.84,31.35 U$15.GND2
  Top 0.305: U3.2 11.89,23.81 11.57,23.49
  other vias: 21.59,18.41 9.84,17.46 13.65,17.46 13.34,23.81 9.53,23.81 14.61,19.68 18.1,23.49 16.51,22.54 16.19,21.27 25.4,20.95 5.08,9.21 9.84,21.91 18.1,25.08 20,18.41 24.77,13.34 3.49,29.84 3.49,26.67 3.49,40.32 3.49,42.86 3.49,30.8 3.49,31.75 3.49,32.7 3.49,33.66 3.49,34.61 3.49,35.56 3.49,36.51 3.49,37.47 3.49,38.42 3.49,39.37 3.49,25.72 2.86,25.08 1.91,25.08 0.95,25.08 18.59,42.02 21.69,28.17 15.59,34.52 15.49,39.22 16.39,35.52 20.79,35.32 21.59,35.32 10.09,36.52 12.39,33.72 13.89,29.62 34.88,42.42 9.64,19.76 24.7,22.36 31.99,42.52 31.49,32.32 25.5,18.31 6.24,18.26 3.37,15.84 16.51,7.94 17.14,7.94 16.51,7.3 17.14,7.3 17.14,6.67 16.51,6.67 16.51,6.03 17.14,6.03 18.41,4.13 18.41,3.17 18.41,2.22 18.41,1.27 22.23,5.4 26.35,4.44 22.86,4.76 22.23,4.76 26.35,3.81 26.35,3.17 26.35,2.54 27.3,2.22 27.94,2.22 31.43,4.44 31.43,3.81 31.43,3.17 31.43,2.54 6.03,9.21 5.08,8.25 5.08,7.3 4.04,12.72 7.3,12.06 22.86,5.4 24.77,7.3 25.4,7.3 26.04,7.3 16.19,4.76 16.83,4.76 17.46,4.76 58.74,35.88 57.78,35.88 56.83,35.88 55.88,35.88 54.93,35.88 53.98,35.88 53.02,35.88 52.07,35.88 51.12,35.88 50.16,35.88 50.16,34.92 50.16,33.97 50.16,33.02 50.16,32.07 50.16,31.11 50.16,30.16 50.16,29.21 50.16,28.26 50.16,27.3 51.12,27.3 52.07,27.3 53.02,27.3 54.29,27.3 55.24,27.3 56.2,27.3 57.15,27.3 58.1,27.3 58.74,26.67 57.15,25.08 57.15,24.13 50.16,4.13 50.16,3.17 52.07,2.22 53.34,2.22 55.56,5.08 55.56,4.13 31.43,20.64 31.43,19.05 27.62,23.18 29.53,23.18 19.97,35.31 31.43,33.34 31.43,34.29 31.43,35.24 27.3,35.88 28.26,35.88 29.53,35.88 29.84,26.04 30.8,26.04 31.75,26.04 53.34,42.55 53.34,41.59 30.16,42.55 31.11,42.55 40.32,23.49 39.69,17.78 44.13,20.32 39.69,15.56 39.69,12.7 55.56,11.11 49.53,21.27 49.53,18.73 39.05,33.97 42.23,33.97 25.72,26.67 12.75,18.56 34.5,22.54 31.4,12.43 32.5,12.43
  pour Bottom: -2.22,25.4 -2.22,-4.13 71.12,-4.13 71.12,45.72 3.17,45.72 3.17,25.4
  pour Top: -3.81,29.21 -3.81,-2.22 64.45,-1.59 64.45,46.67 3.17,46.67 3.17,25.4 -2.86,25.4 -2.86,29.21
GPOUT
  Top 0.203: U1.12 23.08,16.93 23.35,16.93 24.3,17.88 R10.1
GPS_ON  (via drill 0.35)
  Top 0.203: U$14.42 14.4,42.71 14.66,42.97 21.82,42.97 21.84,42.95 22.55,42.95 25.7,39.8 v25.7,39.71
  Top 0.254: v25.7,39.71 R1.1
GPS_VCC  (via drill 0.35)
  Top 0.254: v21,38.3 22.41,38.3 23.18,37.52 23.18,34.72 24.41,33.5 Q2.3
  Bottom 0.254: U$17.1 14.52,39.18 15.58,40.24 17.57,40.24 19.51,38.3 v21,38.3
L_RST  (via drill 0.35)
  Top 0.152: U$14.15 6.7,30.21 6.9,30.01 8.14,30.01 8.34,30.21 8.34,31.29 8.48,31.44 9.13,31.44 10.51,32.82 v11,32.82 | v36.53,28.91 37.18,28.26 37.18,27.4 39.32,25.27 39.32,22.99 38.6,22.28 36.61,22.28 34.65,20.32 34.65,13.61 36.92,11.34 U$15.NRST
  Bottom 0.152: v11,32.82 11.45,32.82 13.71,32.82 14.02,32.52 14.86,32.52 15.27,32.93 16.53,32.93 16.83,32.63 17.07,32.63 18.66,34.23 24.94,34.23 26.27,32.89 29.59,32.89 32.33,30.15 33.31,30.15 33.34,30.12 | 33.34,30.12 35.3,30.12 36.51,28.91 v36.53,28.91 | 33.34,30.12
L_SS  (via drill 0.35)
  Top 0.152: U$14.41 v13.3,40.91 | v51.75,24.13 52.84,23.04 U$15.NSS
  Bottom 0.152: v13.3,40.91 21.52,40.91 22.48,41.87 23.24,41.87 24.18,40.93 35.18,40.93 39.9,36.21 39.9,30.61 39.9,30.51 46.28,24.13 v51.75,24.13
LED1
  Top 0.203: U$14.5 7.8,27.26 R16.2
LED2
  Top 0.152: R17.2 5.6,27.45 U$14.3
  Top 0.203: 4.5,26.76 R17.2
MISO
  Top 0.152: U$14.28 11.6,39.76 11.6,39.82 11.76,39.99 16.24,39.99 17.37,38.86 18.83,38.86 18.87,38.91 27.45,38.91 29.84,36.51 31.43,36.51 36.2,31.75 41.59,31.75 45.09,28.26 45.09,21.59 46.68,19.99 54.69,19.99 54.82,19.86 54.82,14.18 54.29,13.65 54.06,13.88 U$15.MISO
MOSI  (via drill 0.35)
  Top 0.152: U$14.30 13.3,34.65 14.29,33.66 16.57,33.66 17.37,34.45 22.06,34.45 25.76,30.76 25.76,28.54 29.53,24.76 31.84,24.76 32.13,25.05 32.64,25.05 33.88,23.81 v33.97,23.81 | U$15.MOSI 37.23,16.42 v35.88,17.78
  Bottom 0.152: v33.97,23.81 34.61,23.81 36.01,22.41 U$16.MOSI 36.01,17.91 v35.88,17.78
N$1  (via drill 0.35)
  Top 0.203: v12.38,21.91 13.23,21.06
  Top 0.254: 13.23,21.06 13.97,21.06 R3.1
  Bottom 0.152: D3.C 6.22,13.82 6.71,14.32 6.71,17.51
  Bottom 0.203: v12.38,21.91 11.11,21.91 10.16,20.96 9.21,20.96 8.89,20.64 8.89,19.68 6.71,17.51
N$2
  Top 0.305: R12.2 R13.1 55.92,18.27 Q1.1
N$3
  Top 0.813: U$15.ANT 57.25,31.66 ANT.P
N$4  (via drill 0.35)
  Top 0.305: R22.2 57.05,22.44 v56.83,22.23
  Bottom 0.305: v56.83,22.23 51.75,17.15 42.55,17.15 41.59,18.1 41.61,18.11 U$16.LEDK
N$6
  Top 0.254: U$14.45 18.86,41.28 R14.2
N$7
  Top 0.254: U$14.46 19.51,39.41 R15.2
N$8
  Top 0.254: R1.2 26.83,37.89 R7.1 25.79,36.77 Q2.1
N$11
  Top 0.254: U3.1 14.07,22.86 R3.2
N$12
  Top 0.305: R4.1 8.36,22.86 U3.5
N$13  (via drill 0.35)
  Top 0.203: R16.1 6.35,26.21 v6.3,26.21
  Bottom 0.203: v6.3,26.21 6.3,26.71 6.73,27.14 6.73,32.88 5,34.61 5,36.96 D2.A
N$14  (via drill 0.35)
  Top 0.203: 4.7,24.71 R17.1 3.93,24.09 v3.45,24.09
  Bottom 0.152: D4.A 3.45,24.71 v3.45,24.09
N$15
  Top 0.305: Q1.3 58.15,20.47 R22.1
N$16
  Top 0.813: U$41.3 12.7,6.35 11.75,5.4 11.75,4.44 12.8,3.39 R18.1 15.24,3.39 C17.1
N$17
  Top 0.406: U$41.1 14.23,8.57 14.57,8.22 14.23,7.88 U$41.2
  Top 1.27: U$35.P$2 14.57,8.22 14.61,8.25
N$21
  Top 0.203: C4.1 19.58,21.27 20.64,21.27 20.99,20.92 U1.5
NRF_RST  (via drill 0.35)
  Top 0.254: U$14.48 17.59,37.71 17.24,37.71 17.05,37.9 v16.69,37.9
  Bottom 0.254: v16.69,37.9 16.69,39.2 RST.TP
PHOLD  (via drill 0.35)
  Top 0.254: U2.3 12.7,16.54 v12.7,17.46
  Bottom 0.254: v12.7,17.46 8.26,13.02 8.26,10.16 12.26,6.06 12.26,4.81 12.74,4.32 13.29,4.32 13.78,4.81 13.78,8.38 15.24,9.84 54.93,9.84 55.45,9.32 | 55.33,9.21 55.45,9.32 | 55.45,9.32 U$45.P
PIEZO  (via drill 0.35)
  Top 0.305: U$14.14 5.6,32.41 PZ.TP
  other vias: 5.1,32.91
RXD  (via drill 0.35)
  Top 0.2: RXD.TP 7.8,38.48 U$14.25
  Bottom 0.2: U$17.2 12,37.81 11.2,37.01 10.5,37.01 10.35,37.15 9.83,37.15 9.69,37.01 7.3,37.01 6.83,37.47 RXD.TP
  other vias: 6.83,37.51
RXEN  (via drill 0.35)
  Top 0.152: 15.6,28.36 U$14.12 15.5,29.47 15.56,29.53 15.74,29.53 17.37,31.15 18.83,31.15 19.07,30.91 21.07,30.91 v21.59,31.43 | U$15.RXEN 31.34,16.42 32.07,17.15 32.07,20 33.34,21.27 33.34,22.54 34,23.21 34.22,23.21 34.58,23.56 34.58,24.16 31.83,26.91 30.21,26.91 v30.23,26.93
  Bottom 0.152: v21.59,31.43 25.4,27.62 29.54,27.62 v30.23,26.93
SCK  (via drill 0.35)
  Top 0.152: U$14.29 12.2,36.7 12.99,35.9 12.99,34.52 14.16,33.35 16.7,33.35 16.71,33.36 18.83,33.36 19.12,33.66 22.43,33.66 25.45,30.63 25.45,28.32 29.32,24.45 v32.38,24.45 | U$15.SCK 51.35,18.96 49.21,16.83 37.78,16.83 v36.83,17.78
  Bottom 0.152: v32.38,24.45 34.61,24.45 36.71,22.35 U$16.SCK 36.71,17.9 v36.83,17.78
SCL  (via drill 0.35)
  Top 0.152: U$14.17 8.9,29.84 9.21,29.53 10.13,29.53 10.53,29.12 11.51,29.12 11.65,28.98 11.65,27.53 13.66,25.51 17.13,25.51 17.49,25.16 17.49,23.05 17.83,22.71 19.4,22.71 21.5,22.71 v22.86,21.35
  Top 0.2: JP7.2 18.1,11.75 R6.1
  Top 0.203: U1.2 22.24,20.44 22.24,20.92 22.39,21.07 22.58,21.07 v22.86,21.35
  Bottom 0.203: JP7.2 17.94,11.91 | 17.94,11.91 18.41,12.38 | v22.86,21.35 22.15,21.35 21.59,21.91 19.68,21.91 15.88,18.1 15.88,13.97 17.94,11.91
SDA  (via drill 0.35)
  Top 0.152: U$14.52 18.2,32.7 21.37,32.7 22.85,31.22 22.86,31.22 | 23.45,20.64 23.59,20.64 24.2,21.24 24.74,21.24 25.5,22.01 25.5,25.62 23.79,27.33 23.79,28.87 24.13,29.21 24.13,29.62 24.42,29.91 24.42,30.51 23.81,31.11 22.96,31.11 22.86,31.22 | 22.88,31.22 22.86,31.22 | U1.1 22.61,20.37 23.18,20.37 23.45,20.64 | v23.45,20.37 23.45,20.64
  Top 0.2: R9.1 16.51,14.07 16.51,13.34 15.24,12.06 JP7.1
  Top 0.203: 22.61,20.37 U1.1
  Bottom 0.203: v23.45,20.37 23.45,21.04 23.49,21.08 23.49,21.61 23.12,21.98 22.6,21.98 22.54,21.91 22.09,21.91 21.74,22.26 19.54,22.26 15.28,18 15.28,14.46 15.24,14.42 JP7.1
SWCLK  (via drill 0.35)
  Top 0.254: 9.91,42.67 v10.16,42.92 10,42.76 U$14.38
  Bottom 0.254: TP2.TP v10.16,42.92
SWDIO  (via drill 0.35)
  Top 0.254: U$14.37 8.89,42.54 8.51,42.92 v8.26,42.92
  Bottom 0.254: v8.26,42.92 8,42.92 TP1.TP
SWITCH
  Top 0.152: 21.97,43.32 21.98,43.31
  Top 0.203: U$14.39 11.1,42.67 11.75,43.32 21.97,43.32 | 21.98,43.31 22.7,43.31 24.3,41.71 DWN2.1
TS
  Top 0.203: U1.10 21.79,15.73 22.23,15.29 22.66,15.29 23.24,14.71 R11.2
TXD  (via drill 0.35)
  Top 0.152: U$14.16 7.8,34.39 TXD.TP
  Top 0.2: v10.9,37.91 9.19,37.91 TXD.TP
  Bottom 0.2: U$17.3 10.9,39.08 v10.9,37.91
  other vias: 6.73,35.45
TXEN  (via drill 0.35)
  Top 0.152: U$14.10 13.3,27.51 13.6,27.21 15.73,27.21 16.05,27.53 16.05,28.99 16.18,29.12 17.01,29.12 18.84,27.29 21.89,27.29 v22.57,26.61 | 29.07,13.65 v28.84,13.88
  Bottom 0.152: 27.22,13.88 27.3,13.88 | 27.3,13.88 v28.84,13.88 | v22.57,26.61 26.41,22.76 26.41,14.77 27.3,13.88
USB_N  (via drill 0.35)
  Top 0.152: 21.8,40 R15.1
  Top 0.254: 6.35,19.89 v6.35,20.14 6.23,20.02 JP1.D-1 | v22.86,40 21.8,40
  Bottom 0.254: v6.35,20.14 6.35,19.89 7.22,19.89 7.42,20.09 7.42,31.83 12.41,37.03 21.19,37.03 23.61,39.45 23.61,39.92 23.35,40.18 23.03,40.18 v22.86,40
USB_P  (via drill 0.35)
  Top 0.152: 4.74,19.48 JP1.D+1 | 21.8,40.96 R14.1
  Top 0.254: 6.35,19.48 v6.35,19.23 6.21,19.37 JP1.D+1 | v22.86,40.96 21.8,40.96
  Bottom 0.152: 23.15,40.96 v22.86,40.96
  Bottom 0.254: v6.35,19.23 6.35,19.48 7.39,19.48 7.82,19.92 7.82,30.81 7.82,31.67 12.67,36.63 21.36,36.63 24.02,39.29 24.02,40.09 23.15,40.96
VBAT
  Top 0.203: U1.7 20.59,15.51 19.84,14.77 19.84,14.6 19.84,14.45
  Top 0.305: 19.84,14.45 R5.2 | 19.84,14.6 19.84,16.84 19.23,17.46 17.45,17.46 17.4,17.51 15.1,17.51 12.92,19.68 Q3.3 12.38,19.73 12.38,20.32 11.11,21.59 11.11,24.45 11.43,24.76 U3.3
  Top 0.406: C9.2 15.87,25.08 12.73,25.08 U3.3
VBUS  (via drill 0.35)
  Top 0.152: R2.2 v6.03,21.91 6.03,21.27 | Q3.1 9.85,20.64
  Top 0.203: U$14.47 18.2,38.31
  Top 0.254: JP1.VBUS1 4.79,20.67 | 9.69,25.56 v10.16,26.03 v10.16,26.04 | 18.21,38.42 U$14.47 19.4,38.31 20.12,37.59 C10.2 | 18.2,38.31 17.22,38.31 16.87,38.65 16.33,38.65 15.99,38.32 15.99,36.85 17.05,35.79 17.05,35.25 16.5,34.7 v16.5,34.51
  Top 0.406: D1.A 7.62,22.06 7.4,22.28 7.4,25.35 7.61,25.56 9.69,25.56 9.84,25.4 9.74,25.3 9.74,24.83 U3.4
  Top 0.508: 4.79,20.67 5.4,21.27 6.03,21.27 7.57,21.27 D1.A 9.26,21.22 9.85,20.64
  Bottom 0.254: v10.16,26.04 9.53,26.67 9.53,32.38 11.65,34.51 13.21,34.51 13.85,33.86 15.87,33.86 16.25,34.25 16.25,34.26 v16.5,34.51 | D3.A 5.1,20.98 v6.03,21.91
VHI  (via drill 0.35)
  Top 0.254: v11.1,2.91 11,2.81 11,2.22
  Top 0.406: C7.2 U2.1 12.06,14.61 11.11,15.56 11.11,18.05 Q3.2
  Top 0.508: D1.C 7.67,17.52 8.89,18.73 Q3.2
  Top 0.813: U$35.P$1 8.89,2.22 11,2.22 11.43,2.22 11.96,1.69 R18.2 13.44,1.59 C13.1 | D1.C 7.62,15.88 6.99,15.24 5.34,15.24 3.81,13.71 2.4,13.71 1.3,12.61 1.3,7.33 1.27,7.3 2.67,5.9 C16.1
  Top 1.27: C16.1 5.21,5.9 8.89,2.22
  Bottom 0.152: U$45.S
  Bottom 0.254: U$45.S 54.3,7.91 53,9.21 15.3,9.21 14.2,8.11 14.2,4.41 12.7,2.91 v11.1,2.91

### Text on the board
bPlace: GND | SWD | SWC | v1.2 | SX1262 LoRa Relay | 3V3 | CHG | GND | 3V3 | SDA | SCL | BAT | 5V | GND